# EasyEDA Pro project pcb_design.epro, board 灯板
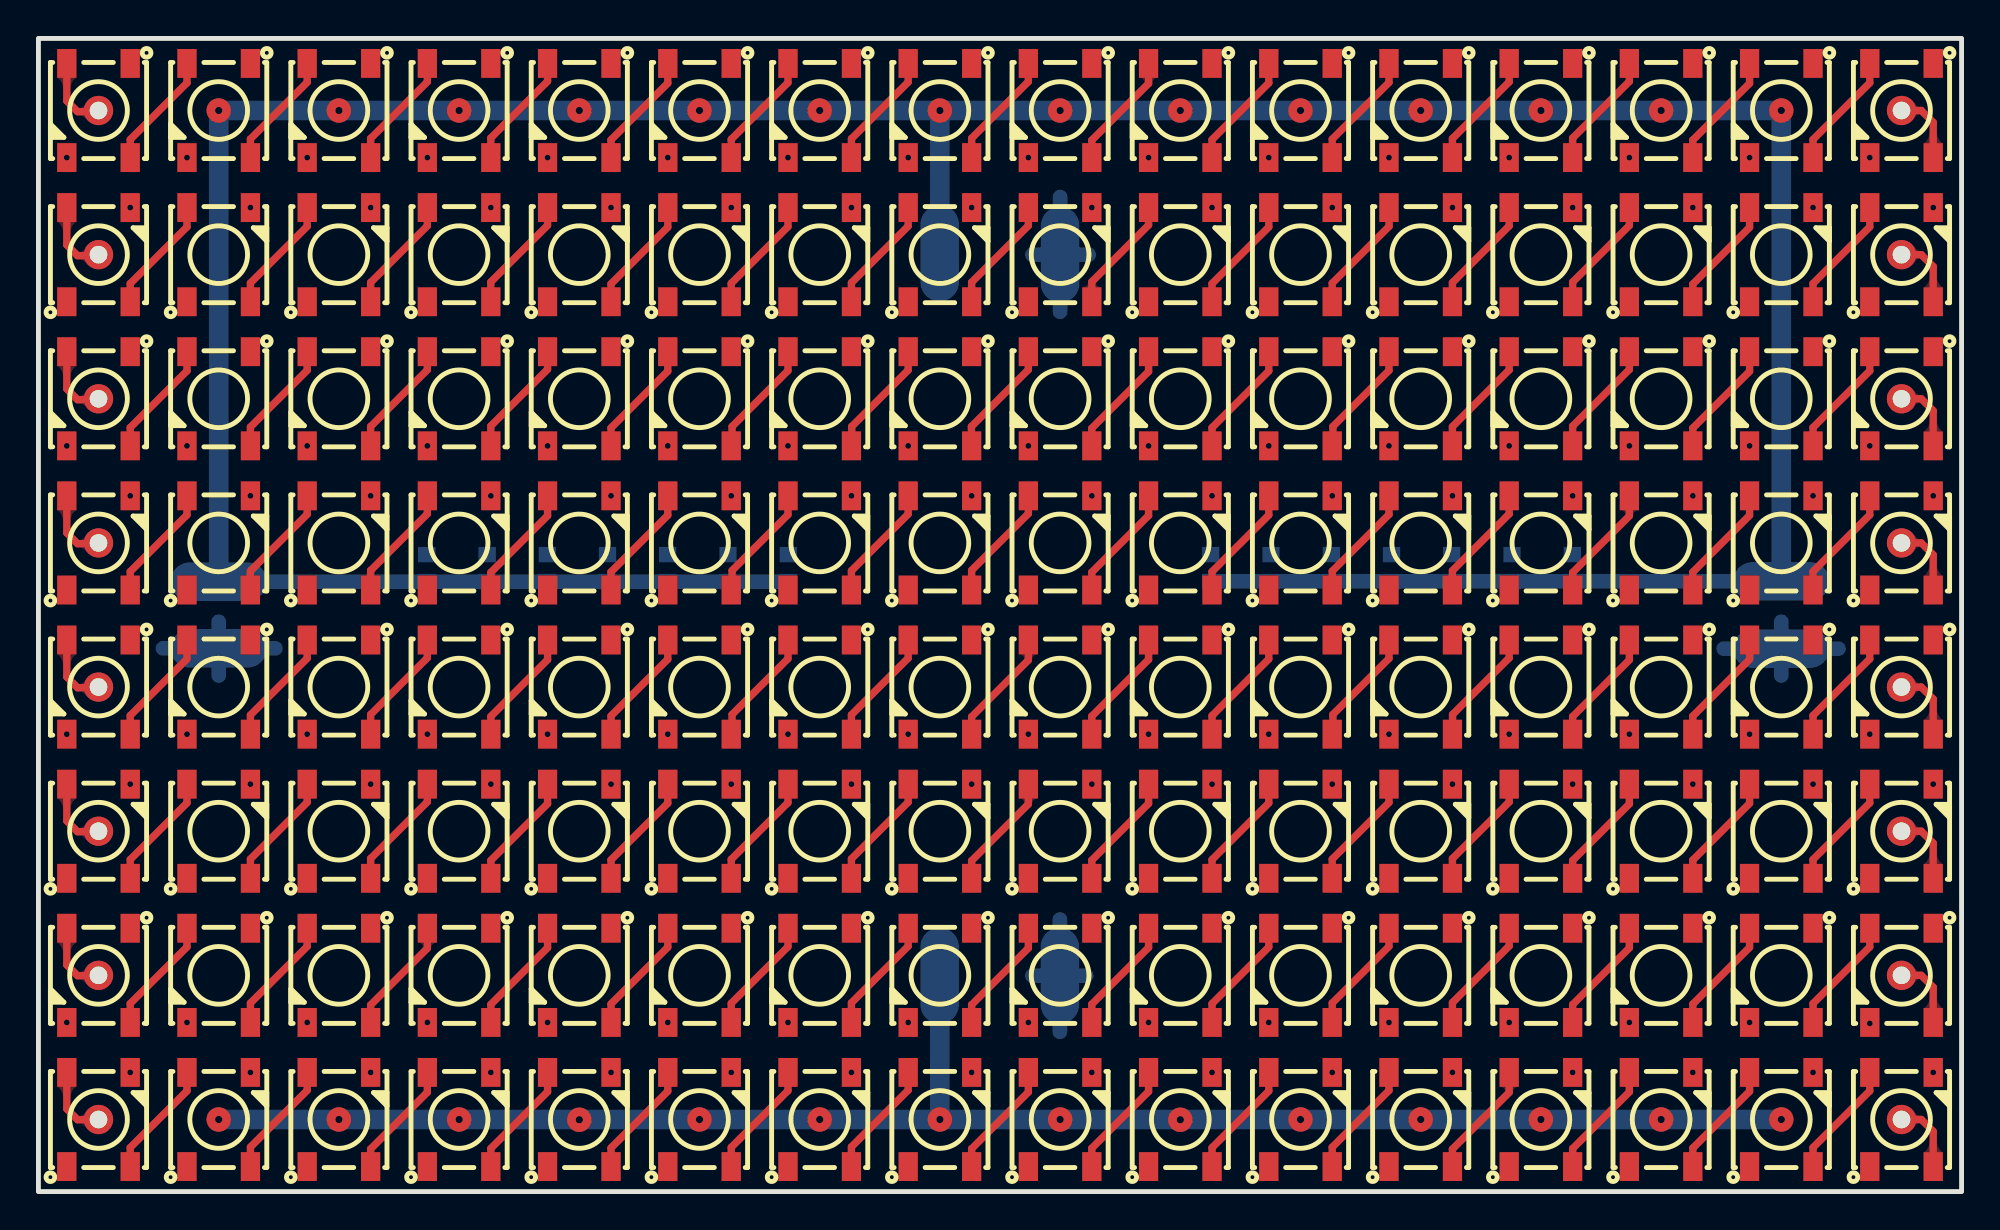
[diagram p4: board, top side]
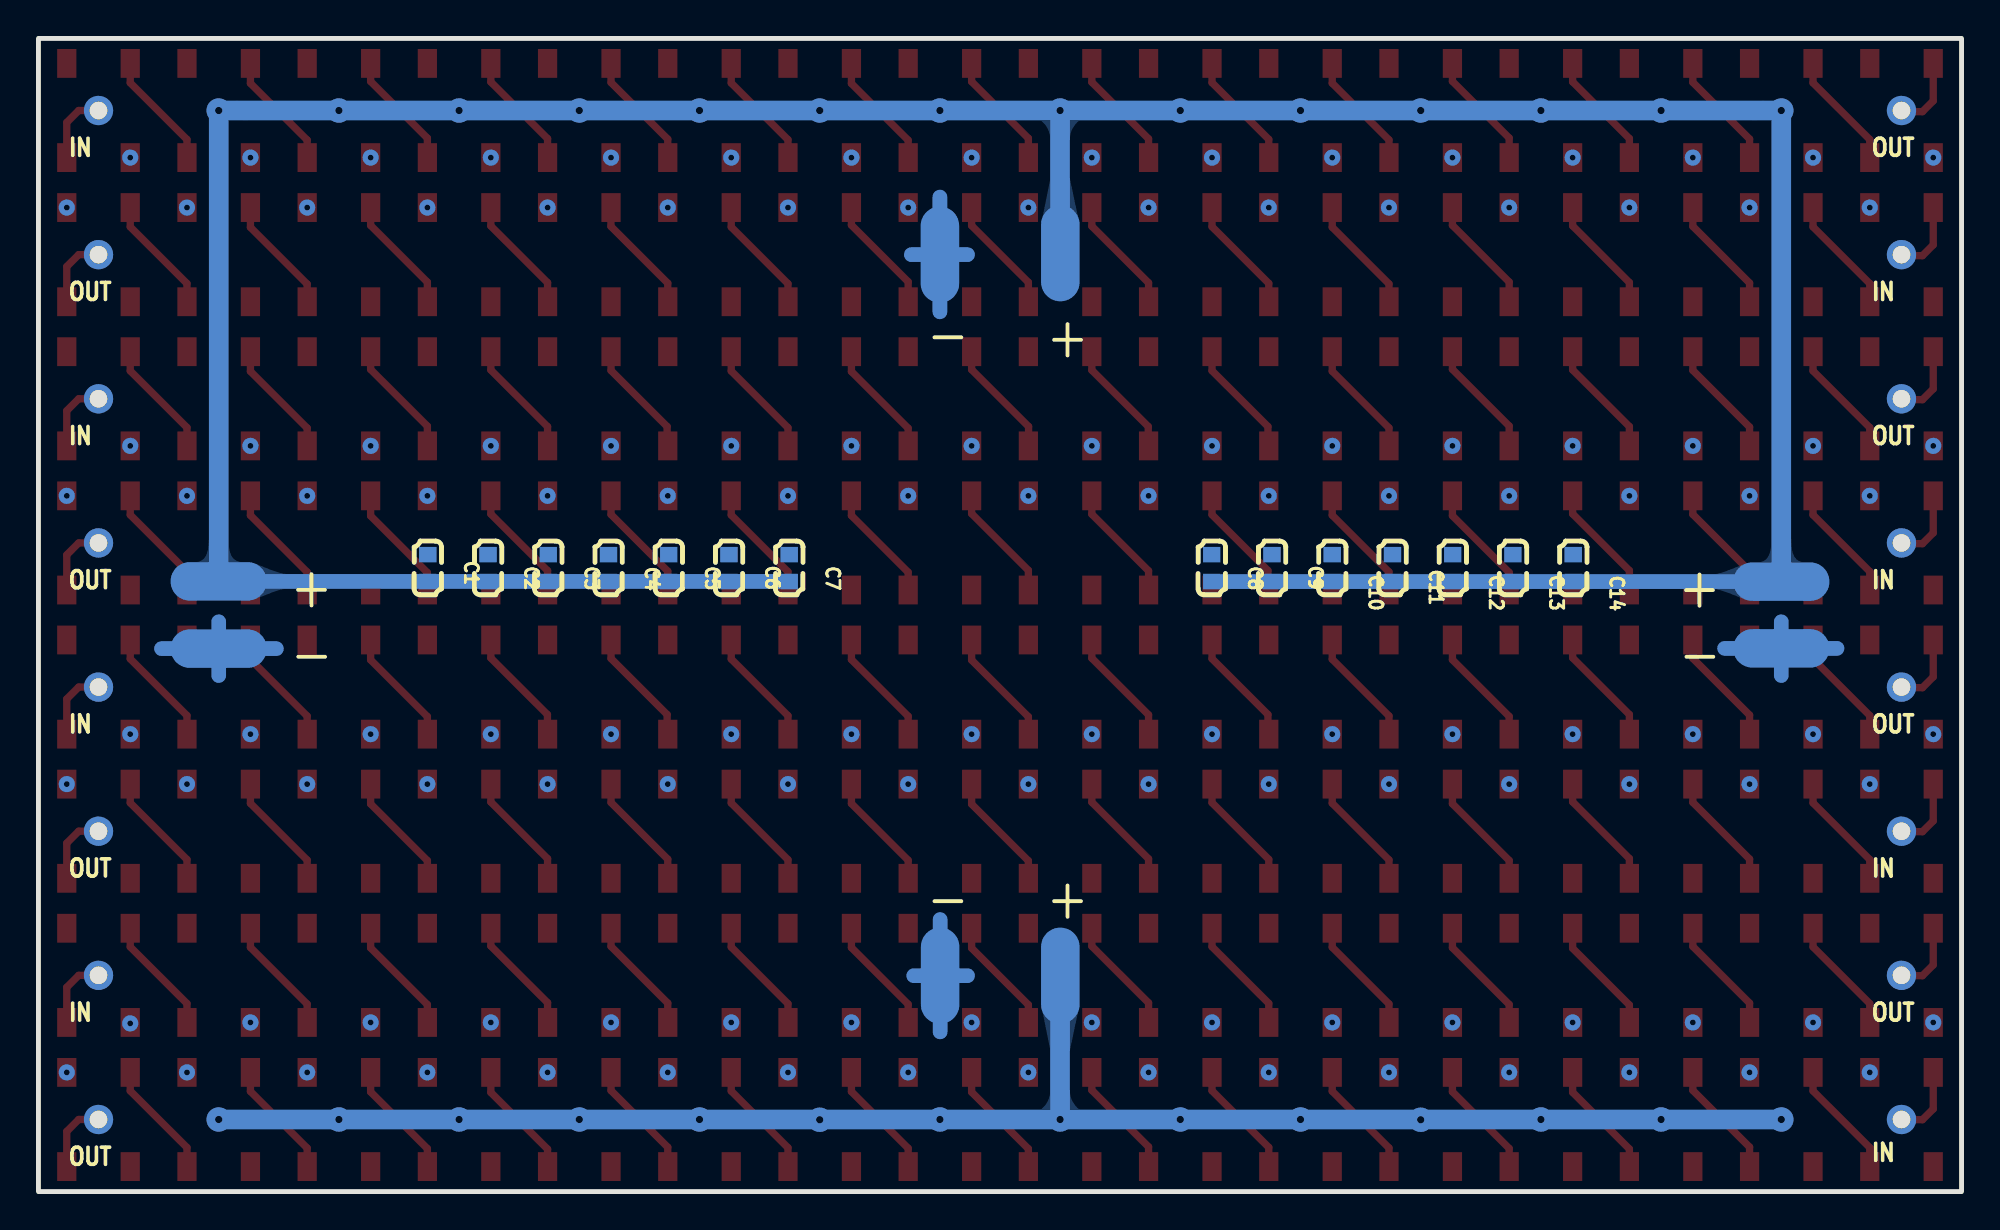
[diagram p5: board, bottom side, seen from below]

Outline 100 x 60 mm; copper layers: Top Layer, Bottom Layer. Coordinates in mm from the lower left corner of the outline.
Outline path: rectangle 0,60 100,0
Stack: Top Layer 0.035mm / Dielectric1 1.51mm FR4 er 4.5 / Bottom Layer 0.035mm

## Design rules (mm)
template: JLCPCB Capability(Two Layers Board)
spacing copperThickness1oz (default): track to track 0.102, other pairs 0.152 to 0.3
spacing copperThickness2oz: track to track 0.203, other pairs 0.152 to 0.3
track width copperThickness1oz (default): min 0.127, default 0.254, max 2.54
track width copperThickness2oz: min 0.203, default 0.254, max 2.54
differential pair differentialPair (default): width min 0.127, default 0.254, max 2.54; gap min 0.152, default 0.152
via viaSize (default): diameter min 0.5, default 0.61, max 10; hole min 0.3, default 0.305, max 6.3

## Placement (name value [footprint] x y rotation side)
C1  1uF  [C0603]  79.76 32.44 270 bottom
C2  1uF  [C0603]  76.62 32.44 270 bottom
C3  1uF  [C0603]  73.49 32.44 270 bottom
C4  1uF  [C0603]  70.36 32.44 270 bottom
C5  1uF  [C0603]  67.23 32.44 270 bottom
C6  1uF  [C0603]  64.09 32.44 270 bottom
C7  1uF  [C0603]  60.96 32.44 270 bottom
C8  1uF  [C0603]  38.99 32.44 270 bottom
C9  1uF  [C0603]  35.86 32.44 270 bottom
C10  1uF  [C0603]  32.72 32.44 270 bottom
C11  1uF  [C0603]  29.59 32.44 270 bottom
C12  1uF  [C0603]  26.46 32.44 270 bottom
C13  1uF  [C0603]  23.33 32.44 270 bottom
C14  1uF  [C0603]  20.19 32.44 270 bottom
LED1  WS2812B-B/T  [LED-SMD_4P-L5.0-W5.0-TL_WS2812B-B]  3.12 56.25 270 top
LED2  WS2812B-B/T  [LED-SMD_4P-L5.0-W5.0-TL_WS2812B-B]  9.37 56.25 270 top
LED3  WS2812B-B/T  [LED-SMD_4P-L5.0-W5.0-TL_WS2812B-B]  15.62 56.25 270 top
LED4  WS2812B-B/T  [LED-SMD_4P-L5.0-W5.0-TL_WS2812B-B]  21.87 56.25 270 top
LED5  WS2812B-B/T  [LED-SMD_4P-L5.0-W5.0-TL_WS2812B-B]  28.12 56.25 270 top
LED6  WS2812B-B/T  [LED-SMD_4P-L5.0-W5.0-TL_WS2812B-B]  34.37 56.25 270 top
LED7  WS2812B-B/T  [LED-SMD_4P-L5.0-W5.0-TL_WS2812B-B]  40.62 56.25 270 top
LED8  WS2812B-B/T  [LED-SMD_4P-L5.0-W5.0-TL_WS2812B-B]  46.88 56.25 270 top
LED9  WS2812B-B/T  [LED-SMD_4P-L5.0-W5.0-TL_WS2812B-B]  53.12 56.25 270 top
LED10  WS2812B-B/T  [LED-SMD_4P-L5.0-W5.0-TL_WS2812B-B]  59.38 56.25 270 top
LED11  WS2812B-B/T  [LED-SMD_4P-L5.0-W5.0-TL_WS2812B-B]  65.63 56.25 270 top
LED12  WS2812B-B/T  [LED-SMD_4P-L5.0-W5.0-TL_WS2812B-B]  71.88 56.25 270 top
LED13  WS2812B-B/T  [LED-SMD_4P-L5.0-W5.0-TL_WS2812B-B]  78.13 56.25 270 top
LED14  WS2812B-B/T  [LED-SMD_4P-L5.0-W5.0-TL_WS2812B-B]  84.38 56.25 270 top
LED15  WS2812B-B/T  [LED-SMD_4P-L5.0-W5.0-TL_WS2812B-B]  90.63 56.25 270 top
LED16  WS2812B-B/T  [LED-SMD_4P-L5.0-W5.0-TL_WS2812B-B]  96.88 56.25 270 top
LED17  WS2812B-B/T  [LED-SMD_4P-L5.0-W5.0-TL_WS2812B-B]  3.12 48.75 90 top
LED18  WS2812B-B/T  [LED-SMD_4P-L5.0-W5.0-TL_WS2812B-B]  9.37 48.75 90 top
LED19  WS2812B-B/T  [LED-SMD_4P-L5.0-W5.0-TL_WS2812B-B]  15.62 48.75 90 top
LED20  WS2812B-B/T  [LED-SMD_4P-L5.0-W5.0-TL_WS2812B-B]  21.87 48.75 90 top
LED21  WS2812B-B/T  [LED-SMD_4P-L5.0-W5.0-TL_WS2812B-B]  28.12 48.75 90 top
LED22  WS2812B-B/T  [LED-SMD_4P-L5.0-W5.0-TL_WS2812B-B]  34.37 48.75 90 top
LED23  WS2812B-B/T  [LED-SMD_4P-L5.0-W5.0-TL_WS2812B-B]  40.62 48.75 90 top
LED24  WS2812B-B/T  [LED-SMD_4P-L5.0-W5.0-TL_WS2812B-B]  46.88 48.75 90 top
LED25  WS2812B-B/T  [LED-SMD_4P-L5.0-W5.0-TL_WS2812B-B]  53.12 48.75 90 top
LED26  WS2812B-B/T  [LED-SMD_4P-L5.0-W5.0-TL_WS2812B-B]  59.38 48.75 90 top
LED27  WS2812B-B/T  [LED-SMD_4P-L5.0-W5.0-TL_WS2812B-B]  65.63 48.75 90 top
LED28  WS2812B-B/T  [LED-SMD_4P-L5.0-W5.0-TL_WS2812B-B]  71.88 48.75 90 top
LED29  WS2812B-B/T  [LED-SMD_4P-L5.0-W5.0-TL_WS2812B-B]  78.13 48.75 90 top
LED30  WS2812B-B/T  [LED-SMD_4P-L5.0-W5.0-TL_WS2812B-B]  84.38 48.75 90 top
LED31  WS2812B-B/T  [LED-SMD_4P-L5.0-W5.0-TL_WS2812B-B]  90.63 48.75 90 top
LED32  WS2812B-B/T  [LED-SMD_4P-L5.0-W5.0-TL_WS2812B-B]  96.88 48.75 90 top
LED33  WS2812B-B/T  [LED-SMD_4P-L5.0-W5.0-TL_WS2812B-B]  3.12 41.25 270 top
LED34  WS2812B-B/T  [LED-SMD_4P-L5.0-W5.0-TL_WS2812B-B]  9.37 41.25 270 top
LED35  WS2812B-B/T  [LED-SMD_4P-L5.0-W5.0-TL_WS2812B-B]  15.62 41.25 270 top
LED36  WS2812B-B/T  [LED-SMD_4P-L5.0-W5.0-TL_WS2812B-B]  21.87 41.25 270 top
LED37  WS2812B-B/T  [LED-SMD_4P-L5.0-W5.0-TL_WS2812B-B]  28.12 41.25 270 top
LED38  WS2812B-B/T  [LED-SMD_4P-L5.0-W5.0-TL_WS2812B-B]  34.37 41.25 270 top
LED39  WS2812B-B/T  [LED-SMD_4P-L5.0-W5.0-TL_WS2812B-B]  40.62 41.25 270 top
LED40  WS2812B-B/T  [LED-SMD_4P-L5.0-W5.0-TL_WS2812B-B]  46.88 41.25 270 top
LED41  WS2812B-B/T  [LED-SMD_4P-L5.0-W5.0-TL_WS2812B-B]  53.12 41.25 270 top
LED42  WS2812B-B/T  [LED-SMD_4P-L5.0-W5.0-TL_WS2812B-B]  59.38 41.25 270 top
LED43  WS2812B-B/T  [LED-SMD_4P-L5.0-W5.0-TL_WS2812B-B]  65.63 41.25 270 top
LED44  WS2812B-B/T  [LED-SMD_4P-L5.0-W5.0-TL_WS2812B-B]  71.88 41.25 270 top
LED45  WS2812B-B/T  [LED-SMD_4P-L5.0-W5.0-TL_WS2812B-B]  78.13 41.25 270 top
LED46  WS2812B-B/T  [LED-SMD_4P-L5.0-W5.0-TL_WS2812B-B]  84.38 41.25 270 top
LED47  WS2812B-B/T  [LED-SMD_4P-L5.0-W5.0-TL_WS2812B-B]  90.63 41.25 270 top
LED48  WS2812B-B/T  [LED-SMD_4P-L5.0-W5.0-TL_WS2812B-B]  96.88 41.25 270 top
LED49  WS2812B-B/T  [LED-SMD_4P-L5.0-W5.0-TL_WS2812B-B]  3.12 33.75 90 top
LED50  WS2812B-B/T  [LED-SMD_4P-L5.0-W5.0-TL_WS2812B-B]  9.37 33.75 90 top
LED51  WS2812B-B/T  [LED-SMD_4P-L5.0-W5.0-TL_WS2812B-B]  15.62 33.75 90 top
LED52  WS2812B-B/T  [LED-SMD_4P-L5.0-W5.0-TL_WS2812B-B]  21.87 33.75 90 top
LED53  WS2812B-B/T  [LED-SMD_4P-L5.0-W5.0-TL_WS2812B-B]  28.12 33.75 90 top
LED54  WS2812B-B/T  [LED-SMD_4P-L5.0-W5.0-TL_WS2812B-B]  34.37 33.75 90 top
LED55  WS2812B-B/T  [LED-SMD_4P-L5.0-W5.0-TL_WS2812B-B]  40.62 33.75 90 top
LED56  WS2812B-B/T  [LED-SMD_4P-L5.0-W5.0-TL_WS2812B-B]  46.88 33.75 90 top
LED57  WS2812B-B/T  [LED-SMD_4P-L5.0-W5.0-TL_WS2812B-B]  53.12 33.75 90 top
LED58  WS2812B-B/T  [LED-SMD_4P-L5.0-W5.0-TL_WS2812B-B]  59.38 33.75 90 top
LED59  WS2812B-B/T  [LED-SMD_4P-L5.0-W5.0-TL_WS2812B-B]  65.63 33.75 90 top
LED60  WS2812B-B/T  [LED-SMD_4P-L5.0-W5.0-TL_WS2812B-B]  71.88 33.75 90 top
LED61  WS2812B-B/T  [LED-SMD_4P-L5.0-W5.0-TL_WS2812B-B]  78.13 33.75 90 top
LED62  WS2812B-B/T  [LED-SMD_4P-L5.0-W5.0-TL_WS2812B-B]  84.38 33.75 90 top
LED63  WS2812B-B/T  [LED-SMD_4P-L5.0-W5.0-TL_WS2812B-B]  90.63 33.75 90 top
LED64  WS2812B-B/T  [LED-SMD_4P-L5.0-W5.0-TL_WS2812B-B]  96.88 33.75 90 top
LED65  WS2812B-B/T  [LED-SMD_4P-L5.0-W5.0-TL_WS2812B-B]  3.12 26.25 270 top
LED66  WS2812B-B/T  [LED-SMD_4P-L5.0-W5.0-TL_WS2812B-B]  9.37 26.25 270 top
LED67  WS2812B-B/T  [LED-SMD_4P-L5.0-W5.0-TL_WS2812B-B]  15.62 26.25 270 top
LED68  WS2812B-B/T  [LED-SMD_4P-L5.0-W5.0-TL_WS2812B-B]  21.87 26.25 270 top
LED69  WS2812B-B/T  [LED-SMD_4P-L5.0-W5.0-TL_WS2812B-B]  28.12 26.25 270 top
LED70  WS2812B-B/T  [LED-SMD_4P-L5.0-W5.0-TL_WS2812B-B]  34.37 26.25 270 top
LED71  WS2812B-B/T  [LED-SMD_4P-L5.0-W5.0-TL_WS2812B-B]  40.62 26.25 270 top
LED72  WS2812B-B/T  [LED-SMD_4P-L5.0-W5.0-TL_WS2812B-B]  46.88 26.25 270 top
LED73  WS2812B-B/T  [LED-SMD_4P-L5.0-W5.0-TL_WS2812B-B]  53.12 26.25 270 top
LED74  WS2812B-B/T  [LED-SMD_4P-L5.0-W5.0-TL_WS2812B-B]  59.38 26.25 270 top
LED75  WS2812B-B/T  [LED-SMD_4P-L5.0-W5.0-TL_WS2812B-B]  65.63 26.25 270 top
LED76  WS2812B-B/T  [LED-SMD_4P-L5.0-W5.0-TL_WS2812B-B]  71.88 26.25 270 top
LED77  WS2812B-B/T  [LED-SMD_4P-L5.0-W5.0-TL_WS2812B-B]  78.13 26.25 270 top
LED78  WS2812B-B/T  [LED-SMD_4P-L5.0-W5.0-TL_WS2812B-B]  84.38 26.25 270 top
LED79  WS2812B-B/T  [LED-SMD_4P-L5.0-W5.0-TL_WS2812B-B]  90.63 26.25 270 top
LED80  WS2812B-B/T  [LED-SMD_4P-L5.0-W5.0-TL_WS2812B-B]  96.88 26.25 270 top
LED81  WS2812B-B/T  [LED-SMD_4P-L5.0-W5.0-TL_WS2812B-B]  3.12 18.75 90 top
LED82  WS2812B-B/T  [LED-SMD_4P-L5.0-W5.0-TL_WS2812B-B]  9.37 18.75 90 top
LED83  WS2812B-B/T  [LED-SMD_4P-L5.0-W5.0-TL_WS2812B-B]  15.62 18.75 90 top
LED84  WS2812B-B/T  [LED-SMD_4P-L5.0-W5.0-TL_WS2812B-B]  21.87 18.75 90 top
LED85  WS2812B-B/T  [LED-SMD_4P-L5.0-W5.0-TL_WS2812B-B]  28.12 18.75 90 top
LED86  WS2812B-B/T  [LED-SMD_4P-L5.0-W5.0-TL_WS2812B-B]  34.37 18.75 90 top
LED87  WS2812B-B/T  [LED-SMD_4P-L5.0-W5.0-TL_WS2812B-B]  40.62 18.75 90 top
LED88  WS2812B-B/T  [LED-SMD_4P-L5.0-W5.0-TL_WS2812B-B]  46.88 18.75 90 top
LED89  WS2812B-B/T  [LED-SMD_4P-L5.0-W5.0-TL_WS2812B-B]  53.12 18.75 90 top
LED90  WS2812B-B/T  [LED-SMD_4P-L5.0-W5.0-TL_WS2812B-B]  59.38 18.75 90 top
LED91  WS2812B-B/T  [LED-SMD_4P-L5.0-W5.0-TL_WS2812B-B]  65.63 18.75 90 top
LED92  WS2812B-B/T  [LED-SMD_4P-L5.0-W5.0-TL_WS2812B-B]  71.88 18.75 90 top
LED93  WS2812B-B/T  [LED-SMD_4P-L5.0-W5.0-TL_WS2812B-B]  78.13 18.75 90 top
LED94  WS2812B-B/T  [LED-SMD_4P-L5.0-W5.0-TL_WS2812B-B]  84.38 18.75 90 top
LED95  WS2812B-B/T  [LED-SMD_4P-L5.0-W5.0-TL_WS2812B-B]  90.63 18.75 90 top
LED96  WS2812B-B/T  [LED-SMD_4P-L5.0-W5.0-TL_WS2812B-B]  96.88 18.75 90 top
LED97  WS2812B-B/T  [LED-SMD_4P-L5.0-W5.0-TL_WS2812B-B]  3.12 11.25 270 top
LED98  WS2812B-B/T  [LED-SMD_4P-L5.0-W5.0-TL_WS2812B-B]  9.37 11.25 270 top
LED99  WS2812B-B/T  [LED-SMD_4P-L5.0-W5.0-TL_WS2812B-B]  15.62 11.25 270 top
LED100  WS2812B-B/T  [LED-SMD_4P-L5.0-W5.0-TL_WS2812B-B]  21.87 11.25 270 top
LED101  WS2812B-B/T  [LED-SMD_4P-L5.0-W5.0-TL_WS2812B-B]  28.12 11.25 270 top
LED102  WS2812B-B/T  [LED-SMD_4P-L5.0-W5.0-TL_WS2812B-B]  34.37 11.25 270 top
LED103  WS2812B-B/T  [LED-SMD_4P-L5.0-W5.0-TL_WS2812B-B]  40.62 11.25 270 top
LED104  WS2812B-B/T  [LED-SMD_4P-L5.0-W5.0-TL_WS2812B-B]  46.88 11.25 270 top
LED105  WS2812B-B/T  [LED-SMD_4P-L5.0-W5.0-TL_WS2812B-B]  53.12 11.25 270 top
LED106  WS2812B-B/T  [LED-SMD_4P-L5.0-W5.0-TL_WS2812B-B]  59.38 11.25 270 top
LED107  WS2812B-B/T  [LED-SMD_4P-L5.0-W5.0-TL_WS2812B-B]  65.63 11.25 270 top
LED108  WS2812B-B/T  [LED-SMD_4P-L5.0-W5.0-TL_WS2812B-B]  71.88 11.25 270 top
LED109  WS2812B-B/T  [LED-SMD_4P-L5.0-W5.0-TL_WS2812B-B]  78.13 11.25 270 top
LED110  WS2812B-B/T  [LED-SMD_4P-L5.0-W5.0-TL_WS2812B-B]  84.38 11.25 270 top
LED111  WS2812B-B/T  [LED-SMD_4P-L5.0-W5.0-TL_WS2812B-B]  90.63 11.25 270 top
LED112  WS2812B-B/T  [LED-SMD_4P-L5.0-W5.0-TL_WS2812B-B]  96.88 11.25 270 top
LED113  WS2812B-B/T  [LED-SMD_4P-L5.0-W5.0-TL_WS2812B-B]  3.12 3.75 90 top
LED114  WS2812B-B/T  [LED-SMD_4P-L5.0-W5.0-TL_WS2812B-B]  9.37 3.75 90 top
LED115  WS2812B-B/T  [LED-SMD_4P-L5.0-W5.0-TL_WS2812B-B]  15.62 3.75 90 top
LED116  WS2812B-B/T  [LED-SMD_4P-L5.0-W5.0-TL_WS2812B-B]  21.87 3.75 90 top
LED117  WS2812B-B/T  [LED-SMD_4P-L5.0-W5.0-TL_WS2812B-B]  28.12 3.75 90 top
LED118  WS2812B-B/T  [LED-SMD_4P-L5.0-W5.0-TL_WS2812B-B]  34.37 3.75 90 top
LED119  WS2812B-B/T  [LED-SMD_4P-L5.0-W5.0-TL_WS2812B-B]  40.62 3.75 90 top
LED120  WS2812B-B/T  [LED-SMD_4P-L5.0-W5.0-TL_WS2812B-B]  46.88 3.75 90 top
LED121  WS2812B-B/T  [LED-SMD_4P-L5.0-W5.0-TL_WS2812B-B]  53.12 3.75 90 top
LED122  WS2812B-B/T  [LED-SMD_4P-L5.0-W5.0-TL_WS2812B-B]  59.38 3.75 90 top
LED123  WS2812B-B/T  [LED-SMD_4P-L5.0-W5.0-TL_WS2812B-B]  65.63 3.75 90 top
LED124  WS2812B-B/T  [LED-SMD_4P-L5.0-W5.0-TL_WS2812B-B]  71.88 3.75 90 top
LED125  WS2812B-B/T  [LED-SMD_4P-L5.0-W5.0-TL_WS2812B-B]  78.13 3.75 90 top
LED126  WS2812B-B/T  [LED-SMD_4P-L5.0-W5.0-TL_WS2812B-B]  84.38 3.75 90 top
LED127  WS2812B-B/T  [LED-SMD_4P-L5.0-W5.0-TL_WS2812B-B]  90.63 3.75 90 top
LED128  WS2812B-B/T  [LED-SMD_4P-L5.0-W5.0-TL_WS2812B-B]  96.88 3.75 90 top
NOREF  -  [Pad_e959]  96.88 26.25 0 top
NOREF#2  -  [Pad_e851]  90.63 31.75 90 top
NOREF#3  -  [Pad_e617]  53.11 11.23 0 top
NOREF#4  -  [Pad_e602]  46.86 48.82 0 top
NOREF#5  -  [Pad_e255]  9.37 28.26 90 top
NOREF#6  -  [Pad_e598]  53.12 48.75 0 top
NOREF#7  -  [Pad_e285]  3.12 11.25 0 top
NOREF#8  -  [Pad_e616]  46.86 11.23 0 top
NOREF#9  -  [Pad_e245]  3.12 48.75 0 top
NOREF#10  -  [Pad_e210]  3.12 18.75 0 top
NOREF#11  -  [Pad_e956]  96.88 41.25 0 top
NOREF#12  -  [Pad_e960]  96.88 11.25 0 top
NOREF#13  -  [Pad_e276]  3.12 56.25 0 top
NOREF#14  -  [Pad_e848]  90.63 28.25 90 top
NOREF#15  -  [Pad_e242]  9.37 31.74 90 top
NOREF#16  -  [Pad_e237]  3.12 3.75 0 top
NOREF#17  -  [Pad_e229]  3.12 33.75 0 top
NOREF#18  -  [Pad_e961]  96.88 18.75 0 top
NOREF#19  -  [Pad_e958]  96.88 56.25 0 top
NOREF#20  -  [Pad_e295]  3.12 41.25 0 top
NOREF#21  -  [Pad_e270]  3.12 26.25 0 top
NOREF#22  -  [Pad_e962]  96.88 3.75 0 top
NOREF#23  -  [Pad_e957]  96.88 33.75 0 top
NOREF#24  -  [Pad_e955]  96.88 48.75 0 top

## Footprints (pads in the part's own frame, mm; a bottom-side part is the same pattern mirrored in y, then rotated)
C0603
  rect 0.8x0.9 smd: 1(-0.7,0) 2(0.7,0)
LED-SMD_4P-L5.0-W5.0-TL_WS2812B-B
  rect 1.5x1 smd: 1(-2.45,1.65) 2(-2.45,-1.65) 3(2.45,-1.65) 4(2.45,1.65)
Pad_e210
  round 1.524 hole 0.914: 2(0,0)
Pad_e229
  round 1.524 hole 0.914: 2(0,0)
Pad_e237
  round 1.524 hole 0.914: 2(0,0)
Pad_e242
  oval 2x5 smd far side: 1(0,0)
Pad_e245
  round 1.524 hole 0.914: 2(0,0)
Pad_e255
  oval 2x5 smd far side: 1(0,0)
Pad_e270
  round 1.524 hole 0.914: 2(0,0)
Pad_e276
  round 1.524 hole 0.914: 2(0,0)
Pad_e285
  round 1.524 hole 0.914: 2(0,0)
Pad_e295
  round 1.524 hole 0.914: 2(0,0)
Pad_e598
  oval 2x5 smd far side: 1(0,0)
Pad_e602
  oval 2x5 smd far side: 1(0,0)
Pad_e616
  oval 2x5 smd far side: 1(0,0)
Pad_e617
  oval 2x5 smd far side: 1(0,0)
Pad_e848
  oval 2x5 smd far side: 1(0,0)
Pad_e851
  oval 2x5 smd far side: 1(0,0)
Pad_e955
  round 1.524 hole 0.914: 2(0,0)
Pad_e956
  round 1.524 hole 0.914: 2(0,0)
Pad_e957
  round 1.524 hole 0.914: 2(0,0)
Pad_e958
  round 1.524 hole 0.914: 2(0,0)
Pad_e959
  round 1.524 hole 0.914: 2(0,0)
Pad_e960
  round 1.524 hole 0.914: 2(0,0)
Pad_e961
  round 1.524 hole 0.914: 2(0,0)
Pad_e962
  round 1.524 hole 0.914: 2(0,0)

## Nets
As in the schematic, except:
GND: C1.1 C2.1 C3.1 C4.1 C5.1 C6.1 C7.1 C8.1 C9.1 C10.1 C11.1 C12.1 C13.1 C14.1 LED1.3 LED2.3 LED3.3 LED4.3 LED5.3 LED6.3 LED7.3 LED8.3 LED9.3 LED10.3 LED11.3 LED12.3 LED13.3 LED14.3 LED15.3 LED16.3 LED17.3 LED18.3 LED19.3 LED20.3 LED21.3 LED22.3 LED23.3 LED24.3 LED25.3 LED26.3 LED27.3 LED28.3 LED29.3 LED30.3 LED31.3 LED32.3 LED33.3 LED34.3 LED35.3 LED36.3 LED37.3 LED38.3 LED39.3 LED40.3 LED41.3 LED42.3 LED43.3 LED44.3 LED45.3 LED46.3 LED47.3 LED48.3 LED49.3 LED50.3 LED51.3 LED52.3 LED53.3 LED54.3 LED55.3 LED56.3 LED57.3 LED58.3 LED59.3 LED60.3 LED61.3 LED62.3 LED63.3 LED64.3 LED65.3 LED66.3 LED67.3 LED68.3 LED69.3 LED70.3 LED71.3 LED72.3 LED73.3 LED74.3 LED75.3 LED76.3 LED77.3 LED78.3 LED79.3 LED80.3 LED81.3 LED82.3 LED83.3 LED84.3 LED85.3 LED86.3 LED87.3 LED88.3 LED89.3 LED90.3 LED91.3 LED92.3 LED93.3 LED94.3 LED95.3 LED96.3 LED97.3 LED98.3 LED99.3 LED100.3 LED101.3 LED102.3 LED103.3 LED104.3 LED105.3 LED106.3 LED107.3 LED108.3 LED109.3 LED110.3 LED111.3 LED112.3 LED113.3 LED114.3 LED115.3 LED116.3 LED117.3 LED118.3 LED119.3 LED120.3 LED121.3 LED122.3 LED123.3 LED124.3 LED125.3 LED126.3 LED127.3 LED128.3 NOREF#3.1 NOREF#5.1 NOREF#6.1 NOREF#14.1
VCC: C1.2 C2.2 C3.2 C4.2 C5.2 C6.2 C7.2 C8.2 C9.2 C10.2 C11.2 C12.2 C13.2 C14.2 LED1.1 LED2.1 LED3.1 LED4.1 LED5.1 LED6.1 LED7.1 LED8.1 LED9.1 LED10.1 LED11.1 LED12.1 LED13.1 LED14.1 LED15.1 LED16.1 LED17.1 LED18.1 LED19.1 LED20.1 LED21.1 LED22.1 LED23.1 LED24.1 LED25.1 LED26.1 LED27.1 LED28.1 LED29.1 LED30.1 LED31.1 LED32.1 LED33.1 LED34.1 LED35.1 LED36.1 LED37.1 LED38.1 LED39.1 LED40.1 LED41.1 LED42.1 LED43.1 LED44.1 LED45.1 LED46.1 LED47.1 LED48.1 LED49.1 LED50.1 LED51.1 LED52.1 LED53.1 LED54.1 LED55.1 LED56.1 LED57.1 LED58.1 LED59.1 LED60.1 LED61.1 LED62.1 LED63.1 LED64.1 LED65.1 LED66.1 LED67.1 LED68.1 LED69.1 LED70.1 LED71.1 LED72.1 LED73.1 LED74.1 LED75.1 LED76.1 LED77.1 LED78.1 LED79.1 LED80.1 LED81.1 LED82.1 LED83.1 LED84.1 LED85.1 LED86.1 LED87.1 LED88.1 LED89.1 LED90.1 LED91.1 LED92.1 LED93.1 LED94.1 LED95.1 LED96.1 LED97.1 LED98.1 LED99.1 LED100.1 LED101.1 LED102.1 LED103.1 LED104.1 LED105.1 LED106.1 LED107.1 LED108.1 LED109.1 LED110.1 LED111.1 LED112.1 LED113.1 LED114.1 LED115.1 LED116.1 LED117.1 LED118.1 LED119.1 LED120.1 LED121.1 LED122.1 LED123.1 LED124.1 LED125.1 LED126.1 LED127.1 LED128.1 NOREF#2.1 NOREF#4.1 NOREF#8.1 NOREF#15.1

Pads without a net: LED1 2; LED16 4; LED17 4; LED32 2; LED33 2; LED48 4; LED49 4; LED64 2; LED65 2; LED80 4; LED81 4; LED96 2; LED97 2; LED112 4; LED113 4; LED128 2; NOREF 2; NOREF#7 2; NOREF#9 2; NOREF#10 2; NOREF#11 2; NOREF#12 2; NOREF#13 2; NOREF#16 2; NOREF#17 2; NOREF#18 2; NOREF#19 2; NOREF#20 2; NOREF#21 2; NOREF#22 2; NOREF#23 2; NOREF#24 2

## Via types
v1: diameter 1.27, hole 0.381, Top Layer to Bottom Layer, 28 vias
v2: diameter 0.838, hole 0.305, Top Layer to Bottom Layer, 128 vias

## Routing (per net, layer and track width the routed paths; a pad name or vN(x,y) marks a point on that pad's centre or on a via; arc(x,y) is an arc through that point)
GND: length 34.9
  Bottom Layer w0.762: NOREF#14.1 90.63,29.65 ; NOREF#14.1 90.63,26.85 ; NOREF#14.1 93.6,28.25 ; NOREF#14.1 87.63,28.25 ; NOREF#5.1 9.37,26.85 ; NOREF#5.1 9.37,29.65 ; NOREF#5.1 12.32,28.26 ; NOREF#5.1 6.48,28.26 ; NOREF#6.1 51.69,48.75 ; NOREF#6.1 53.12,51.75 ; NOREF#6.1 53.12,45.78 ; NOREF#6.1 54.61,48.75 ; NOREF#3.1 54.48,11.23 ; NOREF#3.1 53.11,8.31 ; NOREF#3.1 51.69,11.23 ; NOREF#3.1 53.11,14.15
  vias: v2(1.47,53.8) v2(1.47,38.8) v2(1.47,23.8) v2(1.47,8.8) v2(4.77,51.2) v2(4.77,36.2) v2(4.77,21.2) v2(4.77,6.2) v2(7.72,53.8) v2(7.72,38.8) v2(7.72,23.8) v2(7.72,8.8) v2(11.02,51.2) v2(11.02,36.2) v2(11.02,21.2) v2(11.02,6.2) v2(13.97,53.8) v2(13.97,38.8) v2(13.97,23.8) v2(13.97,8.8) v2(17.27,51.2) v2(17.27,36.2) v2(17.27,21.2) v2(17.27,6.2) v2(20.22,53.8) v2(20.22,38.8) v2(20.22,23.8) v2(20.22,8.8) v2(23.52,51.2) v2(23.52,36.2) v2(23.52,21.2) v2(23.52,6.2) v2(26.47,53.8) v2(26.47,38.8) v2(26.47,23.8) v2(26.47,8.8) v2(29.77,51.2) v2(29.77,36.2) v2(29.77,21.2) v2(29.77,6.2) v2(32.72,53.8) v2(32.72,38.8) v2(32.72,23.8) v2(32.72,8.8) v2(36.02,51.2) v2(36.02,36.2) v2(36.02,21.2) v2(36.02,6.2) v2(38.97,53.8) v2(38.97,38.8) v2(38.97,23.8) v2(38.97,8.8) v2(42.27,51.2) v2(42.27,36.2) v2(42.27,21.2) v2(42.27,6.2) v2(45.22,53.8) v2(45.22,38.8) v2(45.22,23.8) v2(45.22,8.8) v2(48.53,51.2) v2(48.53,36.2) v2(48.53,21.2) v2(48.53,6.2) v2(51.47,53.8) v2(51.47,38.8) v2(51.47,23.8) v2(51.47,8.8) v2(54.78,51.2) v2(54.78,36.2) v2(54.78,21.2) v2(54.78,6.2) v2(57.73,53.8) v2(57.73,38.8) v2(57.73,23.8) v2(57.73,8.8) v2(61.03,51.2) v2(61.03,36.2) v2(61.03,21.2) v2(61.03,6.2) v2(63.98,53.8) v2(63.98,38.8) v2(63.98,23.8) v2(63.98,8.8) v2(67.28,51.2) v2(67.28,36.2) v2(67.28,21.2) v2(67.28,6.2) v2(70.23,53.8) v2(70.23,38.8) v2(70.23,23.8) v2(70.23,8.8) v2(73.53,51.2) v2(73.53,36.2) v2(73.53,21.2) v2(73.53,6.2) v2(76.48,53.8) v2(76.48,38.8) v2(76.48,23.8) v2(76.48,8.8) v2(79.78,51.2) v2(79.78,36.2) v2(79.78,21.2) v2(79.78,6.2) v2(82.73,53.8) v2(82.73,38.8) v2(82.73,23.8) v2(82.73,8.8) v2(86.03,51.2) v2(86.03,36.2) v2(86.03,21.2) v2(86.03,6.2) v2(88.98,53.8) v2(88.98,38.8) v2(88.98,23.8) v2(88.98,8.8) v2(92.28,51.2) v2(92.28,36.2) v2(92.28,21.2) v2(92.28,6.2) v2(95.23,53.8) v2(95.23,38.8) v2(95.23,23.8) v2(95.23,8.75) v2(98.53,51.2) v2(98.53,36.2) v2(98.53,21.2) v2(98.53,6.2)
VCC: length 285.6
  Bottom Layer w0.762: NOREF#2.1 61.09,31.75 ; NOREF#15.1 38.86,31.74
  Bottom Layer w1.016: v1(46.88,3.75) v1(40.62,3.75) v1(34.37,3.75) v1(21.87,3.75) v1(15.62,3.75) v1(9.37,3.75) ; v1(46.88,3.75) 46.88,11.22 NOREF#8.1 ; v1(46.88,3.75) v1(53.12,3.75) v1(65.63,3.75) v1(71.88,3.75) v1(78.13,3.75) v1(84.38,3.75) v1(90.63,3.75) ; v1(46.88,56.25) v1(53.12,56.25) v1(59.38,56.25) v1(65.63,56.25) v1(71.88,56.25) v1(78.13,56.25) v1(84.38,56.25) v1(90.63,56.25) NOREF#2.1 ; v1(46.88,56.25) v1(40.62,56.25) v1(34.37,56.25) v1(28.12,56.25) v1(21.87,56.25) v1(15.62,56.25) v1(9.37,56.25) NOREF#15.1 ; v1(46.88,56.25) 46.88,48.79 46.82,48.74
  vias: v1(28.12,3.74) v1(59.38,3.74)
(no net): length 60.5
  Top Layer w0.381: LED113.4 1.47,4.3 2.03,3.74 3.11,3.74 NOREF#16.2 ; LED17.4 1.47,49.26 2.03,48.7 3.07,48.7 NOREF#9.2 ; LED49.4 1.47,34.27 2.03,33.71 3.08,33.71 NOREF#17.2 ; LED16.4 98.53,55.63 97.91,56.25 NOREF#19.2 ; LED96.2 98.53,18.13 97.91,18.75 NOREF#18.2 ; LED80.4 98.53,25.63 97.91,26.25 NOREF.2 ; LED64.2 98.53,33.13 97.91,33.75 NOREF#23.2 ; LED65.2 1.47,26.78 2.03,26.22 3.09,26.22 NOREF#21.2 ; LED81.4 1.47,19.28 2.03,18.72 3.1,18.72 NOREF#10.2 ; NOREF#13.2 3.06,56.19 2.03,56.19 1.47,56.75 LED1.2 ; LED33.2 1.47,41.76 2.03,41.2 3.08,41.2 NOREF#20.2 ; NOREF#12.2 97.91,11.25 98.53,10.63 LED112.4 ; LED97.2 1.47,11.79 2.03,11.23 3.1,11.23 NOREF#7.2 ; NOREF#22.2 97.91,3.75 98.53,3.13 LED128.2 ; NOREF#24.2 97.91,48.75 98.53,48.13 LED32.2 ; LED48.4 98.53,40.63 97.91,41.25 NOREF#11.2
$1N4664: length 6.1
  Top Layer w0.381: LED8.2 45.22,57.73 42.27,54.78 LED7.4
$1N4665: length 6.1
  Top Layer w0.381: LED6.4 36.02,54.75 38.97,57.7 LED7.2
$1N4666: length 6.1
  Top Layer w0.381: LED5.4 29.77,54.72 32.72,57.67 LED6.2
$1N4667: length 6.1
  Top Layer w0.381: LED5.2 26.47,57.77 23.52,54.82 LED4.4
$1N4668: length 6.1
  Top Layer w0.381: LED4.2 20.22,57.74 17.27,54.79 17.27,53.8
$1N4669: length 6.1
  Top Layer w0.381: LED2.4 11.02,54.77 13.97,57.72 LED3.2
$1N4670: length 6.1
  Top Layer w0.381: LED1.4 4.77,54.74 7.72,57.69 LED2.2
$1N4671: length 6.1
  Top Layer w0.381: LED9.2 51.47,57.75 48.53,54.8 LED8.4
$1N4672: length 6.1
  Top Layer w0.381: LED9.4 54.78,54.7 57.73,57.65 LED10.2
$1N4673: length 6.1
  Top Layer w0.381: LED10.4 61.03,54.73 63.98,57.68 LED11.2
$1N4674: length 6.1
  Top Layer w0.381: LED11.4 67.28,54.76 70.23,57.71 LED12.2
$1N4675: length 6.1
  Top Layer w0.381: LED12.4 73.53,54.79 76.48,57.74 LED13.2
$1N4676: length 6.1
  Top Layer w0.381: LED14.2 82.73,57.76 79.78,54.81 79.78,53.8
$1N4677: length 6.1
  Top Layer w0.381: LED15.2 88.98,57.66 86.03,54.71 LED14.4
$1N4678: length 6.1
  Top Layer w0.381: LED15.4 92.28,54.74 95.23,57.69 LED16.2
$1N4679: length 6.1
  Top Layer w0.381: LED24.4 45.22,50.23 42.27,47.28 LED23.2
$1N4680: length 6.1
  Top Layer w0.381: LED22.2 36.02,47.26 38.97,50.21 LED23.4
$1N4681: length 6.1
  Top Layer w0.381: LED21.2 29.77,47.23 32.72,50.18 LED22.4
$1N4682: length 6.1
  Top Layer w0.381: LED20.2 23.52,47.33 26.47,50.28 LED21.4
$1N4683: length 6.1
  Top Layer w0.381: 17.27,46.3 17.27,47.3 20.22,50.25 LED20.4
$1N4684: length 6.1
  Top Layer w0.381: LED18.2 11.02,47.27 13.97,50.22 LED19.4
$1N4685: length 6.1
  Top Layer w0.381: LED17.2 4.77,47.25 7.72,50.2 LED18.4
$1N4686: length 6.1
  Top Layer w0.381: LED25.4 51.47,50.26 48.53,47.31 LED24.2
$1N4687: length 6.1
  Top Layer w0.381: LED25.2 54.78,47.34 57.73,50.29 LED26.4
$1N4688: length 6.1
  Top Layer w0.381: LED26.2 61.03,47.24 63.98,50.19 LED27.4
$1N4689: length 6.1
  Top Layer w0.381: LED27.2 67.28,47.27 70.23,50.22 70.23,51.2 LED28.4
$1N4690: length 6.1
  Top Layer w0.381: LED28.2 73.53,47.29 76.48,50.24 LED29.4
$1N4691: length 6.1
  Top Layer w0.381: 79.78,46.3 79.78,47.32 82.73,50.27 LED30.4
$1N4692: length 6.1
  Top Layer w0.381: LED30.2 86.03,47.22 88.98,50.17 LED31.4
$1N4693: length 6.1
  Top Layer w0.381: LED31.2 92.28,47.25 95.23,50.2 LED32.4
$1N4694: length 6.1
  Top Layer w0.381: LED40.2 45.22,42.74 42.29,39.81 42.29,38.82 LED39.4
$1N4695: length 6.1
  Top Layer w0.381: LED38.4 36.07,38.84 36.07,39.81 38.97,42.71 LED39.2
$1N4696: length 6.1
  Top Layer w0.381: LED37.4 29.77,39.74 32.72,42.69 LED38.2
$1N4697: length 6.1
  Top Layer w0.381: LED36.4 23.52,39.83 26.47,42.79 LED37.2
$1N4698: length 6.1
  Top Layer w0.381: 17.27,38.8 17.27,39.81 20.22,42.76 LED36.2
$1N4699: length 6.1
  Top Layer w0.381: LED35.2 13.97,42.73 11.02,39.78 LED34.4
$1N4700: length 6.1
  Top Layer w0.381: LED33.4 4.77,39.75 7.72,42.7 LED34.2
$1N4701: length 6.1
  Top Layer w0.381: LED41.2 51.47,42.77 48.51,39.81 48.51,38.81 LED40.4
$1N4702: length 6.1
  Top Layer w0.381: LED42.2 57.73,42.67 54.78,39.72 LED41.4
$1N4703: length 6.1
  Top Layer w0.381: LED42.4 61.03,39.75 63.98,42.7 LED43.2
$1N4704: length 6.1
  Top Layer w0.381: LED43.4 67.31,38.83 67.31,39.81 70.23,42.72 LED44.2
$1N4705: length 6.1
  Top Layer w0.381: LED44.4 73.53,39.8 76.48,42.75 LED45.2
$1N4706: length 6.1
  Top Layer w0.381: 79.78,38.8 79.78,39.83 82.73,42.78 LED46.2
$1N4707: length 6.1
  Top Layer w0.381: LED47.2 88.98,42.68 86.03,39.73 LED46.4
$1N4708: length 6.1
  Top Layer w0.381: LED47.4 92.28,39.76 95.23,42.71 LED48.2
$1N4709: length 6.1
  Top Layer w0.381: LED56.4 45.22,35.25 42.27,32.3 LED55.2
$1N4710: length 6.1
  Top Layer w0.381: LED55.4 38.97,35.22 36.07,32.31 36.07,31.34 LED54.2
$1N4711: length 6.1
  Top Layer w0.381: LED53.2 29.77,32.24 32.72,35.19 LED54.4
$1N4712: length 6.1
  Top Layer w0.381: LED52.2 23.52,32.22 26.47,35.17 LED53.4
$1N4713: length 6.1
  Top Layer w0.381: 17.27,31.3 17.27,32.31 20.22,35.27 LED52.4
$1N4714: length 6.1
  Top Layer w0.381: LED51.4 13.97,35.24 11.02,32.29 LED50.2
$1N4715: length 6.1
  Top Layer w0.381: LED49.2 4.77,32.26 7.72,35.21 LED50.4
$1N4716: length 6.1
  Top Layer w0.381: LED56.2 48.53,32.33 51.47,35.28 LED57.4
$1N4717: length 6.1
  Top Layer w0.381: LED58.4 57.73,35.18 54.78,32.22 LED57.2
$1N4718: length 6.1
  Top Layer w0.381: LED59.4 63.98,35.2 61.03,32.25 LED58.2
$1N4719: length 6.1
  Top Layer w0.381: LED60.4 70.23,35.23 67.28,32.28 LED59.2
$1N4720: length 6.1
  Top Layer w0.381: LED61.4 76.48,35.26 73.53,32.31 LED60.2
$1N4721: length 6.1
  Top Layer w0.381: 79.78,31.3 79.78,32.21 82.73,35.16 LED62.4
$1N4722: length 6.1
  Top Layer w0.381: LED62.2 86.03,32.23 88.98,35.19 LED63.4
$1N4723: length 6.1
  Top Layer w0.381: LED63.2 92.28,32.26 95.23,35.21 LED64.4
$1N4724: length 6.1
  Top Layer w0.381: LED71.4 42.27,24.8 45.22,27.75 LED72.2
$1N4725: length 6.1
  Top Layer w0.381: LED70.4 36.07,23.84 36.07,24.82 38.97,27.73 LED71.2
$1N4726: length 6.1
  Top Layer w0.381: LED70.2 32.72,27.7 29.77,24.75 LED69.4
$1N4727: length 6.1
  Top Layer w0.381: LED69.2 26.47,27.67 23.52,24.72 LED68.4
$1N4728: length 6.1
  Top Layer w0.381: 17.27,23.8 17.27,24.82 20.22,27.77 LED68.2
$1N4729: length 6.1
  Top Layer w0.381: LED67.2 13.97,27.75 11.02,24.79 LED66.4
$1N4730: length 6.1
  Top Layer w0.381: LED66.2 7.72,27.72 4.77,24.77 LED65.4
$1N4731: length 6.1
  Top Layer w0.381: LED72.4 48.53,24.7 51.47,27.66 LED73.2
$1N4732: length 6.1
  Top Layer w0.381: LED73.4 54.78,24.73 57.73,27.68 LED74.2
$1N4733: length 6.1
  Top Layer w0.381: LED75.2 63.98,27.71 61.03,24.76 LED74.4
$1N4734: length 6.1
  Top Layer w0.381: LED76.2 70.23,27.74 67.31,24.82 67.31,23.83 LED75.4
$1N4735: length 6.1
  Top Layer w0.381: LED76.4 73.53,23.81 73.53,24.82 76.48,27.77 LED77.2
$1N4736: length 6.1
  Top Layer w0.381: LED78.2 82.73,27.67 79.78,24.72 79.78,23.8
$1N4737: length 6.1
  Top Layer w0.381: LED78.4 86.03,24.74 88.98,27.69 LED79.2
$1N4738: length 6.1
  Top Layer w0.381: LED80.2 95.23,27.72 92.28,24.77 LED79.4
$1N4739: length 6.1
  Top Layer w0.381: LED87.2 42.27,17.31 45.22,20.26 LED88.4
$1N4740: length 6.1
  Top Layer w0.381: LED87.4 38.97,20.23 36.02,17.28 LED86.2
$1N4741: length 6.1
  Top Layer w0.381: LED85.2 29.77,17.26 32.72,20.21 LED86.4
$1N4742: length 6.1
  Top Layer w0.381: LED85.4 26.47,20.18 23.52,17.23 LED84.2
$1N4743: length 6.1
  Top Layer w0.381: 17.27,16.3 17.27,17.33 20.22,20.28 LED84.4
$1N4744: length 6.1
  Top Layer w0.381: LED82.2 11.02,17.3 13.97,20.25 LED83.4
$1N4745: length 6.1
  Top Layer w0.381: LED82.4 7.72,20.22 4.77,17.27 LED81.2
$1N4746: length 6.1
  Top Layer w0.381: LED89.4 51.47,20.16 48.53,17.21 LED88.2
$1N4747: length 6.1
  Top Layer w0.381: LED89.2 54.78,17.24 57.73,20.19 LED90.4
$1N4748: length 6.1
  Top Layer w0.381: LED91.4 63.98,20.22 61.03,17.27 LED90.2
$1N4749: length 6.1
  Top Layer w0.381: LED91.2 67.28,17.29 70.23,20.24 LED92.4
$1N4750: length 6.1
  Top Layer w0.381: LED93.4 76.48,20.27 73.53,17.32 LED92.2
$1N4751: length 6.1
  Top Layer w0.381: LED94.4 82.73,20.17 79.78,17.22 79.78,16.3
$1N4752: length 6.1
  Top Layer w0.381: LED94.2 86.03,17.25 88.98,20.2 LED95.4
$1N4753: length 6.1
  Top Layer w0.381: LED95.2 92.28,17.28 95.23,20.23 LED96.4
$1N4754: length 6.1
  Top Layer w0.381: LED103.4 42.27,9.82 45.22,12.77 LED104.2
$1N4755: length 6.1
  Top Layer w0.381: LED102.4 36.02,9.79 38.97,12.74 LED103.2
$1N4756: length 6.1
  Top Layer w0.381: LED102.2 32.72,12.71 29.77,9.76 LED101.4
$1N4757: length 6.1
  Top Layer w0.381: LED100.4 23.52,9.74 26.47,12.69 LED101.2
$1N4758: length 6.1
  Top Layer w0.381: 17.27,8.8 17.27,9.71 20.22,12.66 LED100.2
$1N4759: length 6.1
  Top Layer w0.381: LED99.2 13.97,12.76 11.02,9.81 LED98.4
$1N4760: length 6.1
  Top Layer w0.381: LED97.4 4.77,9.78 7.72,12.73 LED98.2
$1N4761: length 6.1
  Top Layer w0.381: LED105.2 51.47,12.67 48.53,9.72 LED104.4
$1N4762: length 6.1
  Top Layer w0.381: LED105.4 54.78,9.75 57.73,12.7 LED106.2
$1N4763: length 6.1
  Top Layer w0.381: LED106.4 61.03,9.77 63.98,12.72 LED107.2
$1N4764: length 6.1
  Top Layer w0.381: LED108.2 70.23,12.76 67.28,9.81 LED107.4
$1N4765: length 6.1
  Top Layer w0.381: LED108.4 73.53,9.83 76.48,12.78 LED109.2
$1N4766: length 6.1
  Top Layer w0.381: LED110.2 82.73,12.68 79.78,9.73 79.78,8.8
$1N4767: length 6.1
  Top Layer w0.381: LED111.2 88.98,12.71 86.03,9.76 LED110.4
$1N4768: length 6.1
  Top Layer w0.381: LED111.4 92.28,9.78 95.23,12.73 LED112.2
$1N4769: length 6.1
  Top Layer w0.381: LED120.4 45.22,5.28 42.27,2.33 LED119.2
$1N4770: length 6.1
  Top Layer w0.381: LED118.2 36.02,2.3 38.97,5.25 LED119.4
$1N4771: length 6.1
  Top Layer w0.381: LED117.2 29.77,2.27 32.72,5.22 LED118.4
$1N4772: length 6.1
  Top Layer w0.381: LED116.2 23.52,2.24 26.47,5.19 LED117.4
$1N4773: length 6.1
  Top Layer w0.381: 17.27,1.3 17.27,2.22 20.22,5.17 LED116.4
$1N4774: length 6.1
  Top Layer w0.381: LED115.4 13.97,5.27 11.02,2.32 LED114.2
$1N4775: length 6.1
  Top Layer w0.381: LED114.4 7.72,5.24 4.77,2.29 LED113.2
$1N4776: length 6.1
  Top Layer w0.381: LED120.2 48.53,2.23 51.47,5.18 LED121.4
$1N4777: length 6.1
  Top Layer w0.381: LED122.4 57.73,5.2 54.78,2.25 LED121.2
$1N4778: length 6.1
  Top Layer w0.381: LED122.2 61.03,2.28 63.98,5.23 LED123.4
$1N4779: length 6.1
  Top Layer w0.381: LED123.2 67.28,2.31 70.23,5.26 LED124.4
$1N4780: length 6.1
  Top Layer w0.381: LED124.2 73.53,2.21 76.48,5.16 LED125.4
$1N4781: length 6.1
  Top Layer w0.381: 79.78,1.3 79.78,2.24 82.73,5.19 LED126.4
$1N4782: length 6.1
  Top Layer w0.381: LED127.4 88.98,5.21 86.03,2.26 LED126.2
$1N4783: length 6.1
  Top Layer w0.381: LED128.4 95.23,5.24 92.28,2.29 LED127.2

## Copper pours and planes (outline as drawn; the poured copper is in the pictures)
GND on Bottom Layer: -7.11,68.64 103.25,68.64 103.25,-6.8 -7.11,-6.8
VCC on Top Layer: -1.91,63.05 109.47,63.05 109.47,-3.5 -1.91,-3.5

Small or netless copper shapes (teardrops, artwork), in the pictures only: 39 on Top Layer, 60 on Bottom Layer

## Text on the board
Bottom Silkscreen Layer: OUT | IN | - | +
